# Altium schematic sheet Antena_lora_receptora.SchDoc
size A4; SheetNumber: 2; SheetTotal: 2
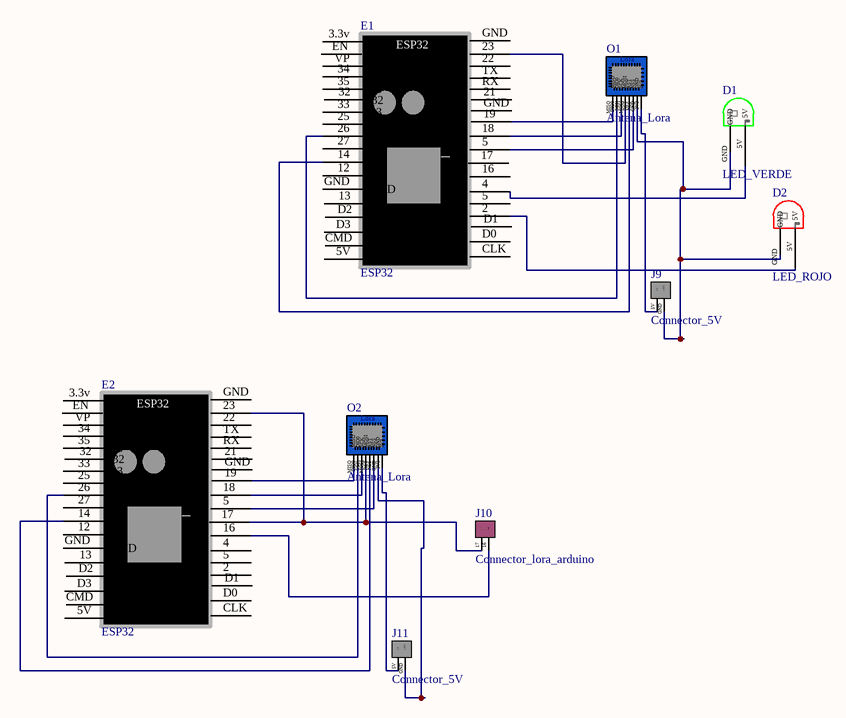
[diagram p0: Antena_lora_receptora.SchDoc]

## Parts
D1  LED_VERDE
D2  LED_ROJO
E1  ESP32
E2  ESP32
J9  Connector_5V  [Conector_5V]
J10  Connector_lora_arduino  [Conector_lora_arduino]
J11  Connector_5V  [Conector_5V]
O1  Antena_Lora
O2  Antena_Lora

## Nets
NetD1_5V: D1.5V E1.4
NetD1_GND: D1.GND D2.GND J9.GND O1.GND
NetD2_5V: D2.5V E1.2
NetE1_5: E1.5 O1.NSS
NetE1_14: E1.14 O1.RST
NetE1_18: E1.18 O1.SCK
NetE1_19: E1.19 O1.MISO
NetE1_23: E1.23 O1.MOSI
NetE1_26: E1.26 O1.DIO0
NetE2_5: E2.5 O2.NSS
NetE2_14: E2.14 O2.RST
NetE2_16: E2.16 J10.16
NetE2_17: E2.17 E2.23 J10.17 O2.MOSI
NetE2_18: E2.18 O2.SCK
NetE2_19: E2.19 O2.MISO
NetE2_26: E2.26 O2.DIO0
NetJ9_5V: J9.5V O1.3V3
NetJ11_5V: J11.5V O2.3V3
NetJ11_GND: J11.GND O2.GND

Not connected (* = marked no-connect by the designer): E1 3.3v 5V 12 13 16 17 21 22 25 27 32 33 34 35 CLK CMD D0 D1 D2 D3 EN GND RX TX VP; E2 2 3.3v 4 5V 12 13 21 22 25 27 32 33 34 35 CLK CMD D0 D1 D2 D3 EN GND RX TX VP

## Notes on the sheet
- (in symbol Antena_Lora) Lora